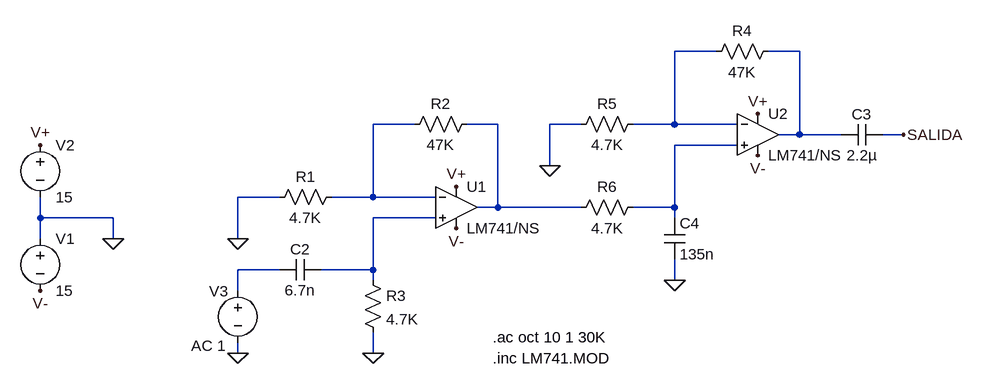
[diagram p0: schematic lm741-filtro-paso-banda.asc]
lm741-filtro-paso-banda.asc, the LTspice schematic file:
Version 4
SHEET 1 1512 680
WIRE 816 -64 752 -64
WIRE 944 -64 896 -64
WIRE 352 48 288 48
WIRE 480 48 432 48
WIRE 608 48 560 48
WIRE 752 48 752 -64
WIRE 752 48 688 48
WIRE 848 48 752 48
WIRE 944 64 944 -64
WIRE 944 64 912 64
WIRE 1008 64 944 64
WIRE 1104 64 1072 64
WIRE 848 80 752 80
WIRE 560 112 560 48
WIRE 144 160 80 160
WIRE 288 160 288 48
WIRE 288 160 224 160
WIRE 384 160 288 160
WIRE 480 176 480 48
WIRE 480 176 448 176
WIRE 608 176 480 176
WIRE 752 176 752 80
WIRE 752 176 688 176
WIRE -224 192 -224 160
WIRE -112 192 -224 192
WIRE 384 192 288 192
WIRE 752 192 752 176
WIRE -224 224 -224 192
WIRE -112 224 -112 192
WIRE 80 224 80 160
WIRE 144 272 80 272
WIRE 288 272 288 192
WIRE 288 272 208 272
WIRE 288 288 288 272
WIRE 752 288 752 256
WIRE 80 304 80 272
WIRE 80 400 80 384
WIRE 288 400 288 368
FLAG -112 224 0
FLAG -224 80 V+
FLAG 416 144 V+
FLAG -224 304 V-
FLAG 416 208 V-
FLAG 80 400 0
FLAG 288 400 0
FLAG 80 224 0
FLAG 1104 64 SALIDA
FLAG 880 32 V+
FLAG 880 96 V-
FLAG 752 288 0
FLAG 560 112 0
SYMBOL Opamps\\opamp2 416 112 R0
SYMATTR InstName U1
SYMATTR Value LM741/NS
SYMBOL voltage -224 208 R0
WINDOW 123 0 0 Left 0
WINDOW 39 0 0 Left 0
SYMATTR InstName V1
SYMATTR Value 15
SYMBOL voltage -224 64 R0
WINDOW 123 0 0 Left 0
WINDOW 39 0 0 Left 0
SYMATTR InstName V2
SYMATTR Value 15
SYMBOL res 448 32 R90
WINDOW 0 0 56 VBottom 2
WINDOW 3 32 56 VTop 2
SYMATTR InstName R2
SYMATTR Value 47K
SYMBOL res 240 144 R90
WINDOW 0 0 56 VBottom 2
WINDOW 3 32 56 VTop 2
SYMATTR InstName R1
SYMATTR Value 4.7K
SYMBOL voltage 80 288 R0
WINDOW 123 -72 101 Left 2
WINDOW 39 0 0 Left 0
WINDOW 0 -44 17 Left 2
WINDOW 3 -175 94 Left 2
SYMATTR Value2 AC 1
SYMATTR InstName V3
SYMATTR Value ""
SYMBOL res 272 272 R0
SYMATTR InstName R3
SYMATTR Value 4.7K
SYMBOL cap 208 256 R90
WINDOW 0 0 32 VBottom 2
WINDOW 3 32 32 VTop 2
SYMATTR InstName C2
SYMATTR Value 6.7n
SYMBOL Opamps\\opamp2 880 0 R0
SYMATTR InstName U2
SYMATTR Value LM741/NS
SYMBOL res 912 -80 R90
WINDOW 0 0 56 VBottom 2
WINDOW 3 32 56 VTop 2
SYMATTR InstName R4
SYMATTR Value 47K
SYMBOL res 704 32 R90
WINDOW 0 0 56 VBottom 2
WINDOW 3 32 56 VTop 2
SYMATTR InstName R5
SYMATTR Value 4.7K
SYMBOL cap 1072 48 R90
WINDOW 0 0 32 VBottom 2
WINDOW 3 32 32 VTop 2
SYMATTR InstName C3
SYMATTR Value 2.2µ
SYMBOL res 704 160 R90
WINDOW 0 0 56 VBottom 2
WINDOW 3 32 56 VTop 2
SYMATTR InstName R6
SYMATTR Value 4.7K
SYMBOL cap 736 192 R0
SYMATTR InstName C4
SYMATTR Value 135n
TEXT 472 376 Left 2 !.ac oct 10 1 30K
TEXT 472 408 Left 2 !.inc LM741.MOD

The netlist it stands for:
* lm741-filtro-paso-banda.asc
XU1 N006 N003 V+ V- N004 LM741/NS  ; pins In+ In- V+ V- OUT
V1 0 V- 15
V2 V+ 0 15
R2 N004 N003 47K
R1 N003 0 4.7K
V3 N007 0 AC 1
R3 N006 0 4.7K
C2 N006 N007 6.7n
XU2 N005 N001 V+ V- N002 LM741/NS  ; pins In+ In- V+ V- OUT
R4 N002 N001 47K
R5 N001 0 4.7K
C3 SALIDA N002 2.2µ
R6 N005 N004 4.7K
C4 N005 0 135n
.ac oct 10 1 30K
.inc LM741.MOD
.backanno
.end